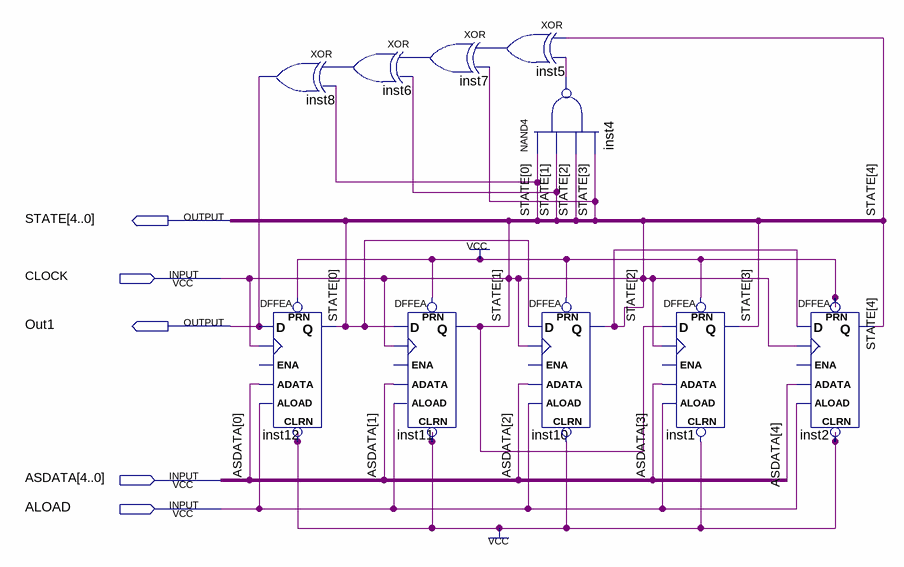
[diagram p0: schematic sheet]
// Quartus schematic Debrain_MGenerator.bdf as structural Verilog: 10 symbols, 5 pins
module Debrain_MGenerator (
  input  CLOCK,
  input  [4:0] ASDATA,
  input  ALOAD,
  output [4:0] STATE,
  output Out1
);

  wire inst4_out, inst5_out, inst6_out, inst7_out;

  xor inst8 (Out1, inst6_out, STATE[0]);
  DFFEA inst12 (
    .PRN(1'b1), .ALOAD(ALOAD), .ADATA(ASDATA[0]), .CLK(CLOCK), .D(Out1), .CLRN(1'b1), .Q(STATE[0]));  // open: ENA
  xor inst6 (inst6_out, inst7_out, CLOCK);
  xor inst7 (inst7_out, inst5_out, STATE[3]);
  DFFEA inst11 (
    .PRN(1'b1), .ALOAD(ALOAD), .ADATA(ASDATA[1]), .CLK(CLOCK), .D(STATE[0]), .CLRN(1'b1), .Q(CLOCK));  // open: ENA
  xor inst5 (inst5_out, STATE[4], inst4_out);
  nand inst4 (inst4_out, STATE[0], CLOCK, CLOCK, STATE[3]);
  DFFEA inst10 (
    .PRN(1'b1), .ALOAD(ALOAD), .ADATA(ASDATA[2]), .CLK(CLOCK), .D(STATE[0]), .CLRN(1'b1), .Q(CLOCK));  // open: ENA
  DFFEA inst1 (
    .PRN(1'b1), .ALOAD(ALOAD), .ADATA(ASDATA[3]), .CLK(CLOCK), .D(CLOCK), .CLRN(1'b1), .Q(STATE[3]));  // open: ENA
  DFFEA inst2 (
    .PRN(1'b1), .ALOAD(ALOAD), .ADATA(ASDATA[4]), .CLK(CLOCK), .D(CLOCK), .CLRN(1'b1), .Q(STATE[4]));  // open: ENA

  assign STATE[2:1] = {2{CLOCK}};
endmodule
